# Altium schematic sheet Power_Supply.SchDoc
size A4; SheetNumber: 2; SheetTotal: 3
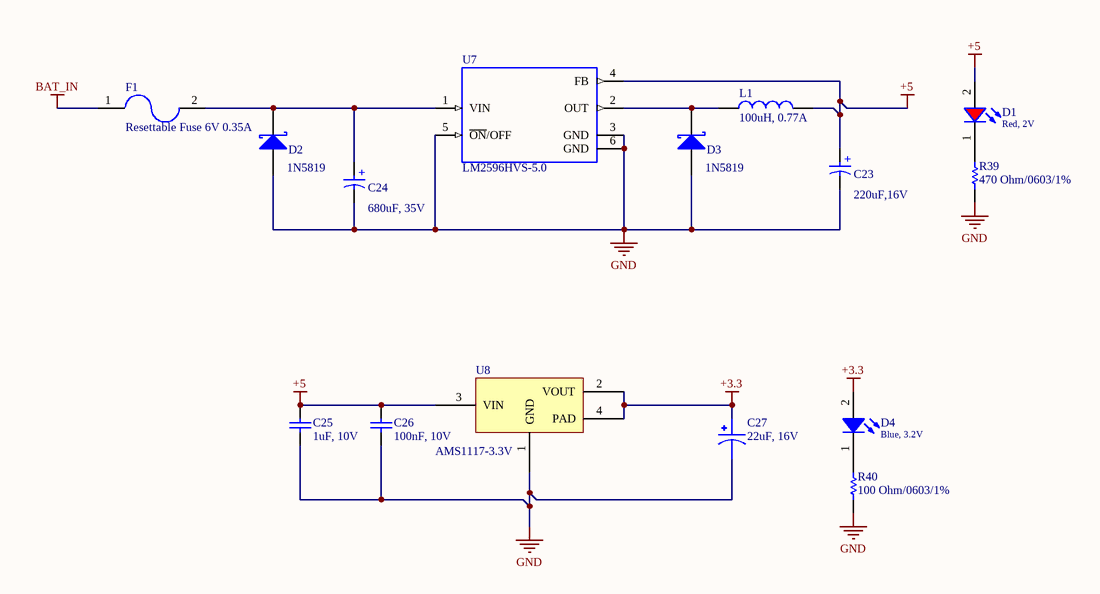
[diagram p0: Power_Supply.SchDoc]

## Parts
C23  value 220uF,16V  [WCAP-ASLI_D6.3H7.7]  (hidden comment: 220uF)
C24  value 680uF, 35V  [WCAP-ASLI_D12.5H14]  (hidden comment: 680uF)
C25  1uF, 10V  [WCAP-CSGP_0603_H=0.8mm_Reflow]
C26  100nF, 10V  [WCAP-CSGP_0603_H=0.8mm_Reflow]
C27  value 22uF, 16V  [C2312]  (hidden comment: Tantalum Capacitor)
D1  Red, 2V  [WL-SMCW_0603 dome]
D2  value 1N5819  [SS34]  (hidden comment: D Schottky)
D3  value 1N5819  [SS34]  (hidden comment: D Schottky)
D4  Blue, 3.2V  [WL-SMCW_0603_H=0.7mm]
F1  value Resettable Fuse 6V 0.35A  [FUSE1206]  (hidden comment: RESETTABLE FUSE 1206)
L1  100uH, 0.77A  [WE-PD2A_7850]
R39  value 470 Ohm/0603/1%  [R0603]  (hidden comment: Resistor 470 Ohm 0603 1%)
R40  value 100 Ohm/0603/1%  [R0603]  (hidden comment: Resistor 100 Ohm 0603 1%)
U7  value LM2596HVS-5.0  [TO-263-5]  (hidden comment: LM2596)
U8  AMS1117-3.3V  [SOT230P700X180-4N]

## Nets
+3.3: C27.1 D4.2(A) U8.2(VOUT) U8.4(PAD)
+5: C23.1(P) C25.2 C26.2 D1.2(A) L1.2 U7.4(FB) U8.3(VIN)
BAT_IN: F1.1
GND: C23.2(N) C24.2(N) C25.1 C26.1 C27.2 D2.1(A) D3.1(A) R39.1 R40.1 U7.3(GND) U7.5(~{ON}/OFF) U7.6(GND) U8.1(GND)
NetC24_1: C24.1(P) D2.2(K) F1.2 U7.1(VIN)
NetD1_1: D1.1(K) R39.2
NetD3_2: D3.2(K) L1.1 U7.2(OUT)
NetD4_1: D4.1(K) R40.2

## Notes on the sheet
- (in symbol 865080345012) +
- (in symbol 865080562017) +

## Library data of the parts
C23 = 865080345012: WCAP-ASLI Aluminum Electrolytic Capacitor, V-Chip, D6.3 x H7.7mm, 220uF, 16V; Manufacturer: Wurth Elektronik; Capacitance Tolerance: +/-20%; Dissipation Factor: 16%; Endurance: 2000h; Leakage Current: 35.2uA; Ripple Current: 275mA; Technical Reference: ASED077221M016DVCTCB000; Manufacturer Part Number: 865080345012; Category: Aluminum Electrolytic Capacitors; Match Code: WCAP-ASLI; ComponentLink1Description: Website Link; ComponentLink1URL: https://www.we-online.com/redexpert/article/865080345012?ad; ComponentLink2Description: Datasheet Link; ComponentLink2URL: https://www.we-online.com/redexpert/spec/865080345012?ad; Mount: Surface Mount; Operating Temperature Max: 105°C; Operating Temperature Min: -55°C; Packaging: Tape and Reel; Height: 7.7mm; Diameter: 6.3mm; Rated Voltage (DC): 16V
C24 = 865080562017: WCAP-ASLI Aluminum Electrolytic Capacitor, V-Chip, D12.5 x H14mm, 680uF, 35V; Manufacturer: Wurth Elektronik; Capacitance Tolerance: +/-20%; Dissipation Factor: 14%; Endurance: 5000h; Leakage Current: 238uA; Ripple Current: 1100mA; Technical Reference: ASEH140681M035DVCTGE000; Manufacturer Part Number: 865080562017; Category: Aluminum Electrolytic Capacitors; Match Code: WCAP-ASLI; ComponentLink1Description: Website Link; ComponentLink1URL: https://www.we-online.com/redexpert/article/865080562017?ad; ComponentLink2Description: Datasheet Link; ComponentLink2URL: https://www.we-online.com/redexpert/spec/865080562017?ad; Mount: Surface Mount; Operating Temperature Max: 105°C; Operating Temperature Min: -55°C; Packaging: Tape and Reel; Height: 14mm; Diameter: 12.5mm; Rated Voltage (DC): 35V
C25 = 885012106010: WCAP-CSGP Multilayer Ceramic Chip Capacitor, General Purpose, size 0603, X5R, 1uF, 10V; Manufacturer: Wurth Elektronik; Rated Voltage: 10VDC; Isolation Resistance: >=0.1GOhm; Capacitance Tolerance: +/-20%; Technical Reference: X5R0603105M010DFCT10000; ComponentLink1Description: Manufacturer; ComponentLink1URL: http://www.we-online.de; ComponentLink2Description: Datasheet; ComponentLink2URL: https://www.we-online.com/catalog/datasheet/885012106010.pdf; Operating Temperature: -55 to +85degC; Packaging: Tape and Reel; Manufacturer Part Number: 885012106010; Published Date: May 2020; Ceramic Type: X5R; Dissipation Factor: =<10%; Height: 0.8mm; Mounting Technology: SMT; Size: 0603; Capacitance: 1uF
C26 = 885012206020: WCAP-CSGP Multilayer Ceramic Chip Capacitor, General Purpose, size 0603, X7R, 100nF, 10V; Manufacturer: Wurth Elektronik; Rated Voltage: 10VDC; Isolation Resistance: >=5GOhm; Capacitance Tolerance: +/-10%; Technical Reference: X7R0603104K010DFCT10000; ComponentLink1Description: Manufacturer; ComponentLink1URL: http://www.we-online.de; ComponentLink2Description: Datasheet; ComponentLink2URL: https://www.we-online.com/catalog/datasheet/885012206020.pdf; Operating Temperature: -55 to +125degC; Packaging: Tape and Reel; Manufacturer Part Number: 885012206020; Published Date: May 2020; Ceramic Type: X7R; Dissipation Factor: =<5%; Height: 0.8mm; Mounting Technology: SMT; Size: 0603; Capacitance: 100nF
C27 = Tantalum Capacitor: Code 226 10%, 2312 (6032 Metric); MF: AVX; MP: TAJC226K016RNJ; Mouser-Purchase-URL: https://snapeda.com/shop?store=Mouser&id=1681916; Price: None; Package: 2312 AVX; Availability: Warning; SnapEDA_Link: https://www.snapeda.com/parts/TAJC226K016RNJ/AVX/view-part/1681916/?ref=snap
D1 = 150060RS86000: WL-SMCW SMT Mono-color Chip LED Waterclear, size 0603 dome, Red, 2V, 60deg; Chip Technology: AlInGaP; Dominant Wavelength typ.: 624nm; Luminous Intensity typ.: 800mcd; Peak Wavelength typ.: 632nm; Viewing Angle: 60deg; ComponentLink1Description: Manufacturer; ComponentLink1URL: http://www.we-online.de; ComponentLink2URL: https://www.we-online.com/catalog/datasheet/150060RS86000.pdf; ComponentLink2Description: Datasheet; Forward Voltage typ.: 2V; Emitting Color: Red; Mounting Technology: SMT; Operating Temperature: -40 to +85degC; Published Date: December 2019; Part Number: 150060RS86000; Packaging: Tape and Reel; Size: 0603 dome; Publisher: Wurth Elektronik
D2 D3 = D Schottky: Schottky Diode; Published: 8-Jun-2000; LatestRevisionDate: 17-Jul-2002; LatestRevisionNote: Re-released for DXP Platform.; PackageReference: SMB; Publisher: Altium Limited; PackageDescription: DO-214-AA/SMB; 2 C-Bend Leads; Body 5.3 x 3.6 mm, inc. leads (LxW); Code_JEDEC: DO-214-AA
D4 = 150060BS75000: WL-SMCW SMT Mono-color Chip LED Waterclear, size 0603, Blue, 3.2V, 140deg; Chip Technology: InGaN; Dominant Wavelength typ.: 470nm; Luminous Intensity typ.: 145mcd; Peak Wavelength typ.: 465nm; Viewing Angle: 140deg; ComponentLink1Description: Manufacturer; ComponentLink1URL: http://www.we-online.de; ComponentLink2URL: https://www.we-online.com/catalog/datasheet/150060BS75000.pdf; ComponentLink2Description: Datasheet; Forward Voltage typ.: 3.2V; Emitting Color: Blue; Mounting Technology: SMT; Operating Temperature: -40 to +85degC; Published Date: December 2019; Part Number: 150060BS75000; Packaging: Tape and Reel; Size: 0603; Publisher: Wurth Elektronik
F1 = RESETTABLE FUSE 1206: Polymeric PTC Resettable Fuse 6V 350mA Ih Surface Mount 1206 _3216 Metric_, Concave; MF: Littelfuse Inc.; MP: 1206L035YR; Package: 1206 Littelfuse; Price: None; Availability: Unavailable; SnapEDA_Link: https://www.snapeda.com/parts/1206L035YR/Littelfuse%20Inc./view-part/225191/?ref=snap
L1 = 78477520: WE-PD2A SMT Power Inductor, size 7850, 100uH, 0.77A; Manufacturer: Wurth Elektronik; DC Resistance max.: 0.43Ohm; Saturation Current: 0.86A; Self Resonant Frequency: 7MHz; DC Resistance typ.: 0.281Ohm; Rated Voltage: 80VDC; ComponentLink1Description: Manufacturer; ComponentLink1URL: http://www.we-online.de; ComponentLink2Description: Datasheet; ComponentLink2URL: https://www.we-online.com/catalog/datasheet/78477520.pdf; Manufacturer Part Number: 78477520; Published Date: May 2020; Rated Current: 0.77A; Inductance: 100uH; Operating Temperature: -40 to +125degC; Mounting Technology: SMT; Packaging: Tape and Reel; Size: 7850
R39 = Resistor 470 Ohm 0603 1%: Code 471, 1/10W; ComponentLink1Description: Buy; ComponentLink1URL: https://www.thegioiic.com/dien-tro-470-ohm-0603-1-
R40 = Resistor 100 Ohm 0603 1%: Code 1000, 1/10W; ComponentLink1Description: Buy; ComponentLink1URL: https://www.thegioiic.com/dien-tro-100-ohm-0603-1-
U7 = LM2596: Simple Switcher Power Converter 150-kHz 4V to 60V, 3A Step-Down Voltage Regulator; MF: Texas Instruments; MP: LM2576HVS-5.0/NOPB; Purchase-URL: https://pricing.snapeda.com/search/part/LM2576HVS-5.0/NOPB/?ref=eda; Package: TO-263-5 Texas Instruments; Check_prices: https://www.snapeda.com/parts/LM2576HVS-5.0/NOPB/Texas+Instruments/view-part/?ref=eda; SnapEDA_Link: https://www.snapeda.com/parts/LM2576HVS-5.0/NOPB/Texas+Instruments/view-part/?ref=snap; Availability: In Stock; Price: None